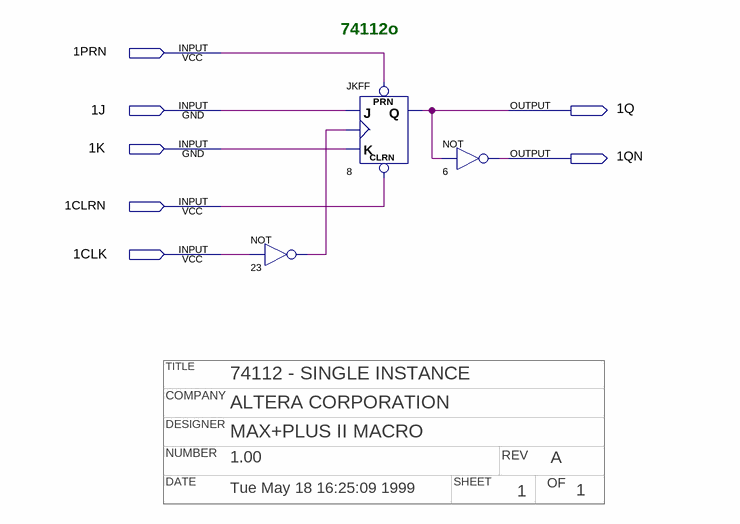
[diagram p0: schematic sheet]
// Quartus schematic 74112o.bdf as structural Verilog: 3 symbols, 7 pins
// Title block: TITLE: 74112 - SINGLE INSTANCE; COMPANY: ALTERA CORPORATION; DESIGNER: MAX+PLUS II MACRO; NUMBER: 1.00; REV: A; DATE: Tue May 18 16:25:09 1999; SHEET: 1; OF: 1
module \74112o  (
  input  \1PRN ,
  input  \1J ,
  input  \1K ,
  input  \1CLRN ,
  input  \1CLK ,
  output \1Q ,
  output \1QN 
);

  wire n23_out;

  not u_23 (n23_out, \1CLK );
  JKFF u_8 (.PRN(\1PRN ), .CLRN(\1CLRN ), .K(\1K ), .J(\1J ), .CLK(n23_out), .Q(\1Q ));
  not u_6 (\1QN , \1Q );

  // Notes on the sheet:
  //   74112o
endmodule
